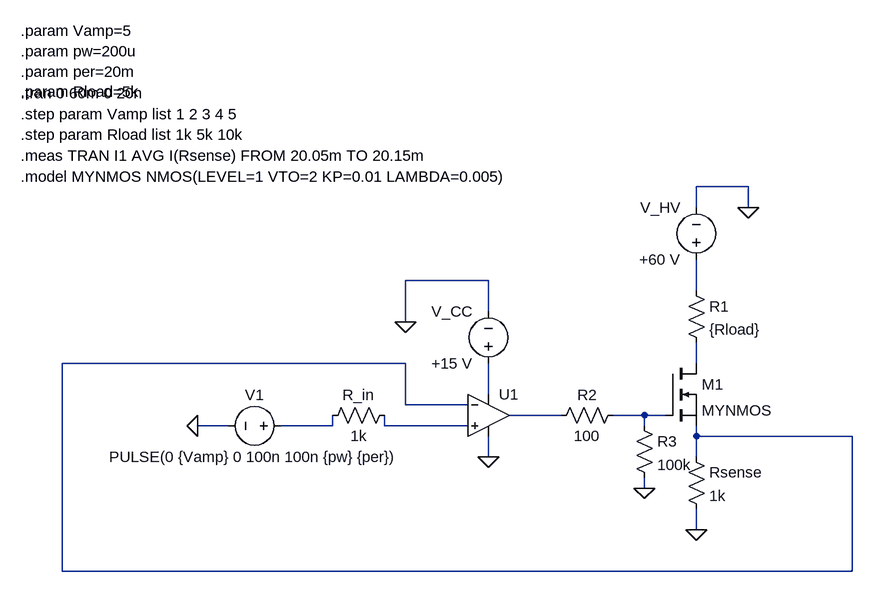
[diagram p0: schematic VCCS.asc]
VCCS.asc, the LTspice schematic file:
Version 4
SHEET 1 880 776
WIRE 112 128 32 128
WIRE 32 160 32 128
WIRE 112 160 112 128
WIRE -288 272 -416 272
WIRE 32 288 32 240
WIRE -288 320 -288 272
WIRE -416 336 -416 272
WIRE -416 400 -944 400
WIRE 32 400 32 368
WIRE -288 448 -288 400
WIRE -416 464 -416 400
WIRE -320 464 -416 464
WIRE -176 480 -256 480
WIRE -48 480 -96 480
WIRE -16 480 -48 480
WIRE -688 496 -736 496
WIRE -528 496 -528 480
WIRE -528 496 -608 496
WIRE -448 496 -448 480
WIRE -320 496 -448 496
WIRE -48 496 -48 480
WIRE 32 512 32 496
WIRE 272 512 32 512
WIRE -288 544 -288 512
WIRE 32 544 32 512
WIRE -48 592 -48 576
WIRE 32 656 32 624
WIRE -944 720 -944 400
WIRE 272 720 272 512
WIRE 272 720 -944 720
FLAG 32 656 0
FLAG -288 544 0
FLAG 112 160 0
FLAG -416 336 0
FLAG -736 496 0
FLAG -48 592 0
SYMBOL voltage 32 256 R180
WINDOW 0 24 96 Left 2
WINDOW 3 24 16 Left 2
SYMATTR InstName V_HV
SYMATTR Value +60 V
SYMBOL voltage -288 416 R180
WINDOW 0 24 96 Left 2
WINDOW 3 24 16 Left 2
SYMATTR InstName V_CC
SYMATTR Value +15 V
SYMBOL Res 16 272 R0
SYMATTR InstName R1
SYMATTR Value {Rload}
SYMBOL nmos -16 400 R0
SYMATTR InstName M1
SYMATTR Value MYNMOS
SYMBOL Res 16 528 R0
SYMATTR InstName Rsense
SYMATTR Value 1k
SYMBOL OpAmps/UniversalOpAmp2 -288 480 R0
SYMATTR InstName U1
SYMBOL Res -80 464 R90
WINDOW 0 0 56 VBottom 2
WINDOW 3 32 56 VTop 2
SYMATTR InstName R2
SYMATTR Value 100
SYMBOL voltage -592 496 R90
WINDOW 0 -32 56 VBottom 2
WINDOW 3 32 56 VTop 2
SYMATTR InstName V1
SYMATTR Value PULSE(0 {Vamp} 0 100n 100n {pw} {per})
SYMBOL Res -432 464 R90
WINDOW 0 0 56 VBottom 2
WINDOW 3 32 56 VTop 2
SYMATTR InstName R_in
SYMATTR Value 1k
SYMBOL Res -64 480 R0
SYMATTR InstName R3
SYMATTR Value 100k
TEXT -1008 -112 Left 2 !.param Vamp=5\n.param pw=200u\n.param per=20m\n.param Rload=5k
TEXT -1008 112 Left 2 !.model MYNMOS NMOS(LEVEL=1 VTO=2 KP=0.01 LAMBDA=0.005)
TEXT -1008 -16 Left 2 !.tran 0 60m 0 20n
TEXT -1008 16 Left 2 !.step param Vamp list 1 2 3 4 5
TEXT -1008 80 Left 2 !.meas TRAN I1 AVG I(Rsense) FROM 20.05m TO 20.15m
TEXT -1008 48 Left 2 !.step param Rload list 1k 5k 10k

The netlist it stands for:
* VCCS.asc
V_HV N001 0 +60 V
V_CC N004 0 +15 V
R1 N001 N003 {Rload}
M1 N003 N006 N002 N002 MYNMOS
Rsense N002 0 1k
XU1 N008 N002 N004 0 N005 level2 Avol=1Meg GBW=10Meg Slew=10Meg Ilimit=25m Rail=0 Vos=0 En=0 Enk=0 In=0 Ink=0 Rin=500Meg  ; pins In+ In- V+ V- OUT
R2 N006 N005 100
V1 N007 0 PULSE(0 {Vamp} 0 100n 100n {pw} {per})
R_in N008 N007 1k
R3 N006 0 100k
.model NMOS NMOS
.model PMOS PMOS
.lib standard.mos
.param Vamp=5
.param pw=200u
.param per=20m
.param Rload=5k
.model MYNMOS NMOS(LEVEL=1 VTO=2 KP=0.01 LAMBDA=0.005)
.tran 0 60m 0 20n
.step param Vamp list 1 2 3 4 5
.meas TRAN I1 AVG I(Rsense) FROM 20.05m TO 20.15m
.step param Rload list 1k 5k 10k
.lib UniversalOpAmp2.lib
.backanno
.end